# EAGLE schematic ShieldClon_0_00 (EAGLE 6.5.0)
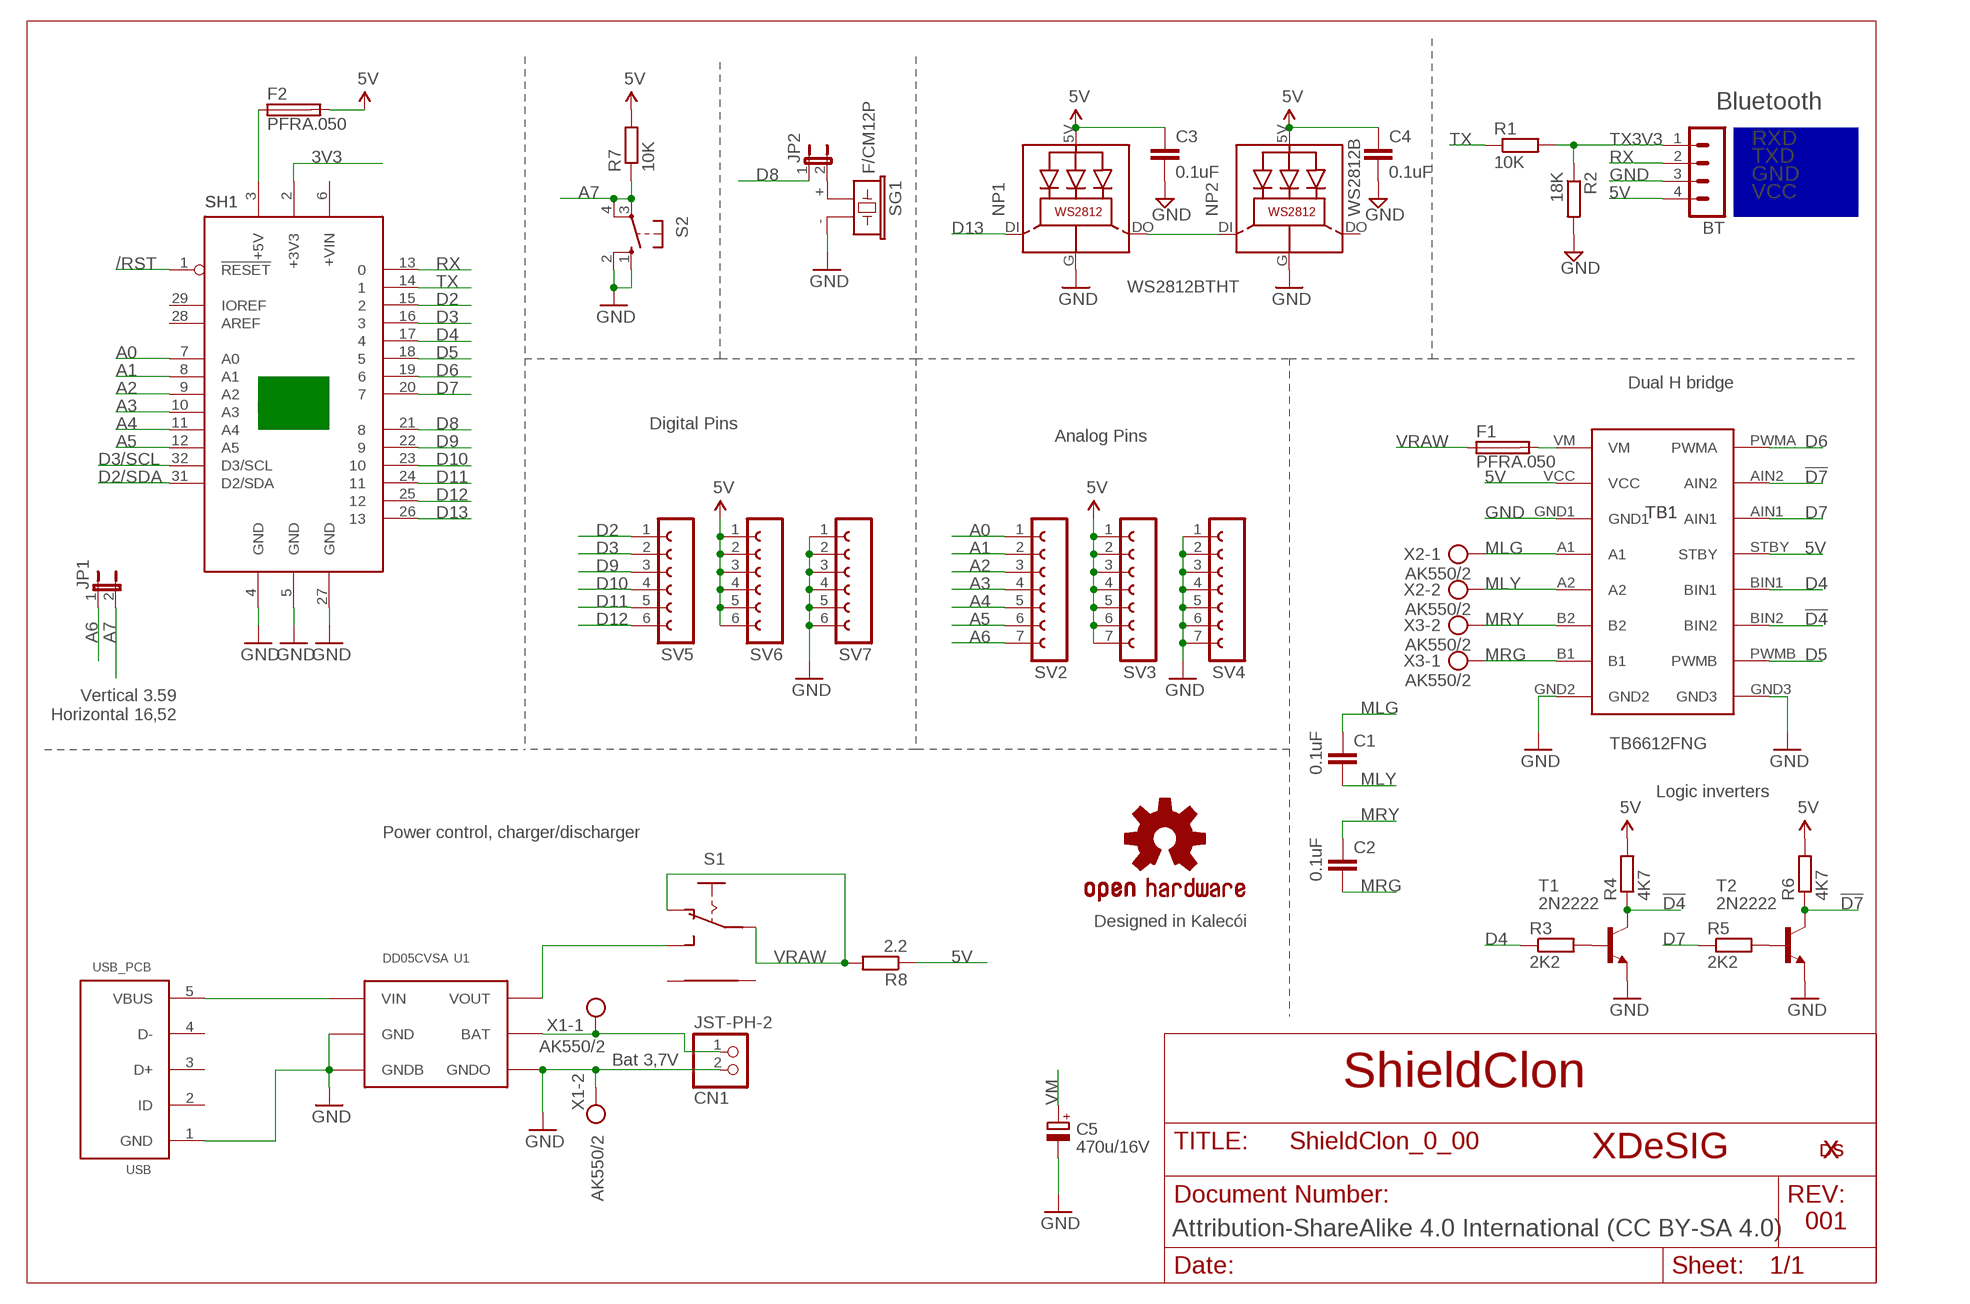
[diagram p0: schematic, sheet 1]

## Parts
BT  MA04-1  [MA04-1]
C1  0.1uF  C-EU050-024X044  [C050-024X044]
C2  0.1uF  C-EU050-024X044  [C050-024X044]
C3  0.1uF  C-EU050-024X044  [C050-024X044]
C4  0.1uF  C-EU050-024X044  [C050-024X044]
C5  470u/16V  CPOL-EUE2.5-7  [E2,5-7]
CN1  JST-PH-2  JST_2PIN-THM-RA  [JST-PH-2-THM-RA]
F1  PFRA.050  FUSETE5  [TE5]
F2  PFRA.050  FUSETE5  [TE5]
JP1  JP1E  [JP1]
JP2  JUMPER_JP1E  [JUMPER_JP1]
LOGO4  OSHW-LOGOS  [OSHW-LOGO-S]
NP1  WS2812BTHT  [NEOPIXEL5MM]
NP2  WS2812B  WS2812BTHT  [NEOPIXEL5MM]
R1  10K  R-EU_0204/7  [0204/7]
R2  18K  R-EU_0204/7  [0204/7]
R3  2K2  R-EU_0204/7  [0204/7]
R4  4K7  R-EU_0204/7  [0204/7]
R5  2K2  R-EU_0204/7  [0204/7]
R6  4K7  R-EU_0204/7  [0204/7]
R7  10K  R-EU_0204/7  [0204/7]
R8  2.2  R-EU_0204/7  [0204/7]
S1  ESCORNA_SK12F14D  [ESCORNA_SK-12D07]
S2  10-XX  [B3F-10XX]
SG1  F/CM12P  [F/CM12P]
SH1  ARDUINO_LEONARDO  [LEONARDO]
SV2  FE07-1  [FE07]
SV3  FE07-1  [FE07]
SV4  FE07-1  [FE07]
SV5  FE06-1  [FE06]
SV6  FE06-1  [FE06]
SV7  FE06-1  [FE06]
T1  2N2222  [TO92-EBC-OVAL]
T2  2N2222  [TO92-EBC-OVAL]
TB1  TB6612FNG  [TB6612FNG]
U1  DD05CVSA  [DD05CVSA]
U$18  XDESIG21  [XDESIG]
U$19  XDESIG5MM  [XDESIG_CU]
USB  USB_PCB  [USB_PCB]
X1  AK550/2  [AK550/2]
X2  AK550/2  [AK550/2]
X3  AK550/2  [AK550/2]

## Nets
3V3: SH1.2(+3V3)
5V: BT.4 C3.1 C4.1 F2.2 NP1.5V(LEDVDD) NP2.5V(LEDVDD) R4.2 R6.2 R7.2 R8.1 SV3.1 SV3.2 SV3.3 SV3.4 SV3.5 SV3.6 SV3.7 SV6.1 SV6.2 SV6.3 SV6.4 SV6.5 SV6.6 TB1.STBY TB1.VCC
!D4: R4.1 T1.C TB1.BIN2
!D7: R6.1 T2.C TB1.AIN2
/RST: SH1.1(!RESET)
A0: SH1.7(A0) SV2.1
A1: SH1.8(A1) SV2.2
A2: SH1.9(A2) SV2.3
A3: SH1.10(A3) SV2.4
A4: SH1.11(A4) SV2.5
A5: SH1.12(A5) SV2.6
A6: JP1.1 SV2.7
A7: JP1.2 R7.1 S2.3(P) S2.4(P1)
D2: SH1.15 SV5.1
D2/SDA: SH1.31(D2/SDA)
D3: SH1.16 SV5.2
D3/SCL: SH1.32(D3/SCL)
D4: R3.1 SH1.17 TB1.BIN1
D5: SH1.18 TB1.PWMB
D6: SH1.19 TB1.PWMA
D7: R5.1 SH1.20 TB1.AIN1
D8: JP2.1 SH1.21
D9: SH1.22 SV5.3
D10: SH1.23 SV5.4
D11: SH1.24 SV5.5
D12: SH1.25 SV5.6
D13: NP1.DI SH1.26
GND: BT.3 C3.2 C4.2 C5.- CN1.2 NP1.G(GND) NP2.G(GND) R2.2 S2.1(S) S2.2(S1) SG1.- SH1.4(GND) SH1.5(GND) SH1.27(GND) SV4.1 SV4.2 SV4.3 SV4.4 SV4.5 SV4.6 SV4.7 SV7.1 SV7.2 SV7.3 SV7.4 SV7.5 SV7.6 T1.E T2.E TB1.GND1 TB1.GND2 TB1.GND3 U1.P$2(GND) U1.P$4(GNDB) U1.P$5(GNDO) USB.1(GND) X1.2
MLG: C1.1 TB1.A1 X2.1
MLY: C1.2 TB1.A2 X2.2
MRG: C2.2 TB1.B1 X3.1
MRY: C2.1 TB1.B2 X3.2
N$1: R3.2 T1.B
N$2: JP2.2 SG1.+
N$3: F2.1 SH1.3(+5V)
N$4: R5.2 T2.B
N$5: U1.P$1(VIN) USB.5(VBUS)
N$8: CN1.1 U1.P$3(BAT) X1.1
N$9: NP1.DO NP2.DI
N$14: S1.P$3(S) U1.P$6(VOUT)
RX: BT.2 SH1.13
TX: R1.1 SH1.14
TX3V3: BT.1 R1.2 R2.1
VM: C5.+ F1.2 TB1.VM
VRAW: F1.1 R8.2 S1.P$1(P) S1.P$2(O)
Unconnected: NP2.DO S1.P$4 S1.P$5 SH1.6(+VIN) SH1.28(AREF) SH1.29(IOREF) USB.2(ID) USB.3(D+) USB.4(D-)

## Notes on the sheet
- Bluetooth
- RXD
- TXD
- GND
- VCC
- Dual H bridge
- Digital Pins | Analog Pins
- Vertical 3.59
  Horizontal 16,52
- Logic inverters
- Power control, charger/discharger
- Designed in Kalecói
- Bat 3,7V
- ShieldClon
- XDeSIG
- 001
- Attribution-ShareAlike 4.0 International (CC BY-SA 4.0)

## Library data of the parts
BT = con-lstb:MA04-1: PIN HEADER; OC_FARNELL: unknown; OC_NEWARK: unknown
C1-C4 = rcl:C-EU: CAPACITOR, European symbol
C5 = rcl:CPOL-EU: POLARIZED CAPACITOR, European symbol
CN1 = adafruit:JST_2PIN: JST 2-Pin Connectors of various flavors SMT-RA (S2B-PH-SM4) 4UConnector #17311 SMT (B2B-PH-SM4) THM-RA (S2B-PH) THM (B2B-PH)
F1 F2 = fuse:FUSE: Fuse; OC_FARNELL: unknown; OC_NEWARK: unknown
JP1 = jumper:JP1E: JUMPER
JP2 = cervus2.100:JUMPER_JP1E: JUMPER
LOGO4 = SparkFun-Aesthetics:OSHW-LOGO: Open Source Hardware Logo This logo indicates the piece of hardware it is found on incorporates a OSHW license and/or adheres to the definition of open source hardware found here: http://freedomdefined.org/OSHW
NP1 NP2 = adafruit:WS2812B
R1-R8 = rcl:R-EU_: RESISTOR, European symbol
S1 = Escorna_CPU_2_01:ESCORNA_SK12F14
S2 = switch-omron:10-XX: OMRON SWITCH; MPN: B3F-1000; OC_FARNELL: 176432; OC_NEWARK: 36M3542
SG1 = buzzer:F/CM12P: BUZZER Source: Buerklin; OC_FARNELL: unknown; OC_NEWARK: unknown
SH1 = arduino:ARDUINO_LEONARDO: SHIELD FOR ARDUINO LEONARDO DRAW BY Xabier Rosas
SV2-SV4 = con-lsta:FE07-1: FEMALE HEADER; OC_FARNELL: unknown; OC_NEWARK: unknown
SV5-SV7 = con-lsta:FE06-1: FEMALE HEADER; OC_FARNELL: unknown; OC_NEWARK: unknown
T1 T2 = adafruit:2N2222: NPN TRANSISTOR Big oval pads
TB1 = mClonShield_000:TB6612FNG
U1 = escorna_LBREscorna_CPU_2_10:DD05CVSA
U$18 U$19 = xdesig:XDESIG
USB = escorna_LBREscorna_CPU_2_10:USB_PCB
X1-X3 = con-ptr500:AK550/2: CONNECTOR; OC_FARNELL: unknown; OC_NEWARK: unknown

## Net classes
0 default: width 0.254 mm, drill 0.61 mm, clearance 0.254 mm
1 power: width 0.254 mm, drill 0.61 mm, clearance 0.254 mm